# Altium schematic sheet POWER_SUPPLY.SchDoc: POWER_SUPPLY
size A4; Author: NGUYEN QUANG MINH; Organization: My Company; Address1: Address Line 1; Address2: Address Line 2; Address3: Address Line 3; Address4: Address Line 4; SheetNumber: 2; SheetTotal: 5
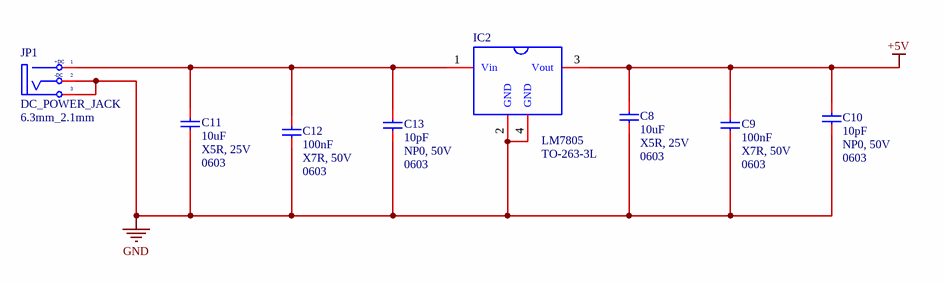
[diagram p0: POWER_SUPPLY.SchDoc]

## Parts
C8  10uF  Temperature Coefficient: X5R, 25V  Package: 0603  [C0603]
C9  100nF  Temperature Coefficient: X7R, 50V  Package: 0603  [C0603]
C10  10pF  Temperature Coefficient: NP0, 50V  Package: 0603  [C0603]
C11  10uF  Temperature Coefficient: X5R, 25V  Package: 0603  [C0603]
C12  100nF  Temperature Coefficient: X7R, 50V  Package: 0603  [C0603]
C13  10pF  Temperature Coefficient: NP0, 50V  Package: 0603  [C0603]
IC2  LM7805  [TO-263-3L]
JP1  DC_POWER_JACK  Reference: 6.3mm_2.1mm  [DC_POWER_JACK_6.3mm_2.1mm]

## Nets
+5V: C8.2 C9.2 C10.2 IC2.3(Vout)
GND: C8.1 C9.1 C10.1 C11.1 C12.1 C13.1 IC2.2(GND) IC2.4(GND) JP1.2(TN) JP1.3(S)
NetC11_2: C11.2 C12.2 C13.2 IC2.1(Vin) JP1.1(T)

## Notes on the sheet
- Author:
- Title:
- Size:
- A4
- Project:
- Approved:
- Revision:
- Modified Date:
- CONFIDENTIAL
- Date:
- SW Version:
- (in symbol DC_POWER_JACK_6.3mm_2.1mm) +DC; -DC

## Library data of the parts
C8 C11 = C0603_MLCC_10uF_X5R_25V: 25V 10uF X5R ±20% 0603 Multilayer Ceramic Capacitors MLCC - SMD/SMT ROHS; Manufacturer: YAGEO; Mfr. Part: CC0603MRX5R8BB106; LCSC Part: C596327; Capacitance: 10uF; Link: https://www.lcsc.com/product-detail/C596327.html; Tolerance: ±20%; Voltage Rating: 25V
C9 C12 = C0603_MLCC_100nF_X7R_50V: 50V 100nF X7R ±10% 0603 Multilayer Ceramic Capacitors MLCC - SMD/SMT ROHS; Manufacturer: YAGEO; Mfr. Part: CC0603KRX7R9BB104; LCSC Part: C14663; Capacitance: 100nF; Link: https://www.lcsc.com/product-detail/C14663.html; Tolerance: ±10%; Voltage Rating: 50V
C10 C13 = C0603_MLCC_10pF_NP0_50V: 50V 10pF NP0 ±5% 0603 Multilayer Ceramic Capacitors MLCC - SMD/SMT ROHS; Manufacturer: YAGEO; Mfr. Part: CC0603JRNPO9BN100; LCSC Part: C106245; Capacitance: 10pF; Link: https://www.lcsc.com/product-detail/C106245.html; Tolerance: ±5%; Voltage Rating: 50V
IC2 = LM7805_TO-263-3L: 62dB@(120Hz) 1A Fixed 4.8V~5.2V Positive 35V TO-263-3L Voltage Regulators - Linear, Low Drop Out (LDO) Regulators ROHS; Manufacturer: HANSCHIP semiconductor; Mfr. Part: LM7805SRG; Number of Outputs: 1; LCSC Part: C5145372; Link: https://www.lcsc.com/product-detail/C5145372.html?s_z=n_lm7805; Category: Power Management (PMIC)/Voltage Regulators - Linear, Low Drop Out (LDO) Regulators; Output Current: 1A; Output Voltage: 4.8V~5.2V; Output Configuration: Positive; Operating Temperature: -40℃~+85℃@(Ta); Voltage - Supply: 35V; Package: TO-263-3L
JP1 = DC_POWER_JACK_6.3mm_2.1mm: Right Angle DC Power Jack -40℃~+85℃ 2.1mm 6.3mm 3A 500V Through Hole DC Power Connectors ROHS; Manufacturer: Lian Xin Technology; Mfr. Part: XDJK-0051-025; LCSC Part: C7498153; Package: Through Hole; Current Rating-Power: 3A; Link: https://www.lcsc.com/product-detail/C7498153.html?s_z=n_XDJK-0051-025; Connector Type: DC Power Jack; Operating Temperature: -40℃~+85℃; Inside Contact Diameter: 2.1mm; Outside Contact Diameter: 6.3mm; Current Rating: 3A; Voltage Rating (Max): 500V